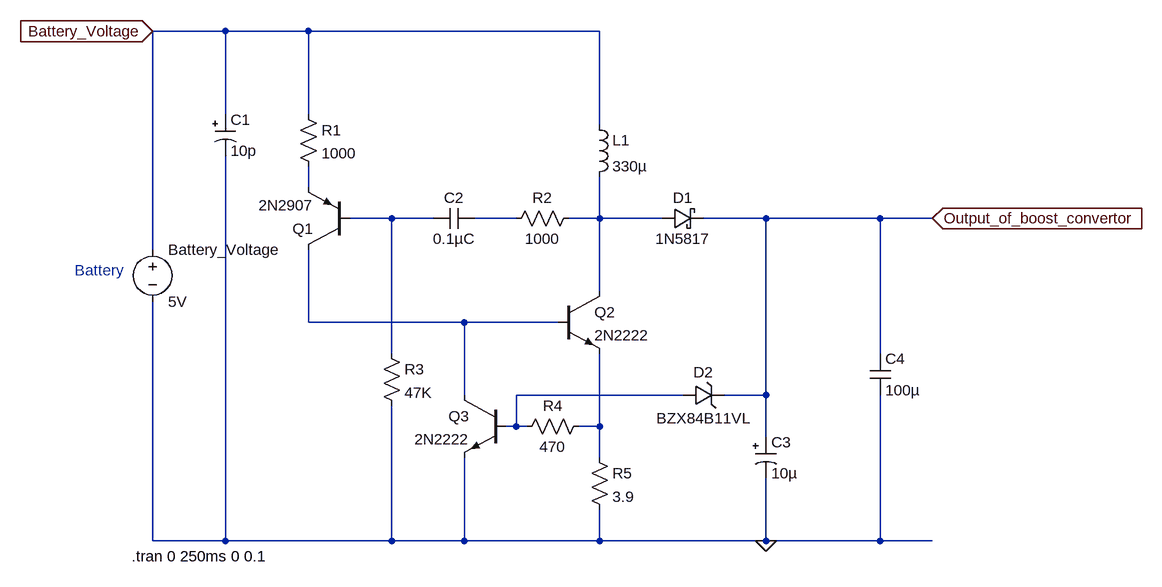
[diagram p0: schematic boost convertor.asc]
boost convertor.asc, the LTspice schematic file:
Version 4
SHEET 1 1632 852
WIRE 160 -16 48 -16
WIRE 288 -16 160 -16
WIRE 736 -16 288 -16
WIRE 160 112 160 -16
WIRE 288 112 288 -16
WIRE 736 128 736 -16
WIRE 288 224 288 192
WIRE 416 272 352 272
WIRE 480 272 416 272
WIRE 608 272 544 272
WIRE 736 272 736 208
WIRE 736 272 688 272
WIRE 832 272 736 272
WIRE 992 272 896 272
WIRE 1168 272 992 272
WIRE 1248 272 1168 272
WIRE 48 320 48 -16
WIRE 736 384 736 272
WIRE 288 432 288 320
WIRE 528 432 288 432
WIRE 672 432 528 432
WIRE 416 480 416 272
WIRE 1168 480 1168 272
WIRE 528 544 528 432
WIRE 864 544 608 544
WIRE 992 544 992 272
WIRE 992 544 928 544
WIRE 608 592 608 544
WIRE 608 592 592 592
WIRE 624 592 608 592
WIRE 736 592 736 480
WIRE 736 592 704 592
WIRE 992 608 992 544
WIRE 736 640 736 592
WIRE 48 768 48 400
WIRE 160 768 160 176
WIRE 160 768 48 768
WIRE 416 768 416 560
WIRE 416 768 160 768
WIRE 528 768 528 640
WIRE 528 768 416 768
WIRE 736 768 736 720
WIRE 736 768 528 768
WIRE 992 768 992 672
WIRE 992 768 736 768
WIRE 1168 768 1168 544
WIRE 1168 768 992 768
WIRE 1248 768 1168 768
FLAG 992 768 0
FLAG 1248 272 Output_of_boost_convertor
IOPIN 1248 272 In
FLAG 48 -16 Battery_Voltage
IOPIN 48 -16 In
SYMBOL polcap 144 112 R0
SYMATTR InstName C1
SYMATTR Value 10p
SYMBOL res 272 96 R0
SYMATTR InstName R1
SYMATTR Value 1000
SYMBOL pnp 352 320 R180
SYMATTR InstName Q1
SYMATTR Value 2N2907
SYMBOL cap 544 256 R90
WINDOW 0 0 32 VBottom 2
WINDOW 3 32 32 VTop 2
SYMATTR InstName C2
SYMATTR Value 0.1µC
SYMBOL res 704 256 R90
WINDOW 0 0 56 VBottom 2
WINDOW 3 32 56 VTop 2
SYMATTR InstName R2
SYMATTR Value 1000
SYMBOL ind 720 112 R0
SYMATTR InstName L1
SYMATTR Value 330µ
SYMBOL schottky 832 288 R270
WINDOW 0 32 32 VTop 2
WINDOW 3 0 32 VBottom 2
SYMATTR InstName D1
SYMATTR Value 1N5817
SYMATTR Description Diode
SYMATTR Type diode
SYMBOL npn 672 384 R0
SYMATTR InstName Q2
SYMATTR Value 2N2222
SYMBOL res 400 464 R0
SYMATTR InstName R3
SYMATTR Value 47K
SYMBOL npn 592 544 M0
SYMATTR InstName Q3
SYMATTR Value 2N2222
SYMBOL res 720 576 R90
WINDOW 0 0 56 VBottom 2
WINDOW 3 32 56 VTop 2
SYMATTR InstName R4
SYMATTR Value 470
SYMBOL zener 864 560 R270
WINDOW 0 36 32 VTop 2
WINDOW 3 -4 32 VBottom 2
SYMATTR InstName D2
SYMATTR Value BZX84B11VL
SYMBOL res 720 624 R0
SYMATTR InstName R5
SYMATTR Value 3.9
SYMBOL polcap 976 608 R0
SYMATTR InstName C3
SYMATTR Value 10µ
SYMBOL voltage 48 304 R0
WINDOW 123 0 0 Left 0
WINDOW 39 0 0 Left 0
SYMATTR InstName Battery_Voltage
SYMATTR Value 5V
SYMBOL cap 1152 480 R0
SYMATTR InstName C4
SYMATTR Value 100µ
TEXT 16 792 Left 2 !.tran 0 250ms 0 0.1
TEXT -72 352 Left 2 ;Battery

The netlist it stands for:
* boost convertor.asc
C1 Battery_Voltage 0 10p
R1 Battery_Voltage N001 1000
Q1 N005 N002 N001 0 2N2907
C2 N003 N002 0.1µC
R2 N004 N003 1000
L1 Battery_Voltage N004 330µ
D1 N004 Output_of_boost_convertor 1N5817
Q2 N004 N005 N007 0 2N2222
R3 N002 0 47K
Q3 N005 N006 0 0 2N2222
R4 N007 N006 470
D2 N006 Output_of_boost_convertor BZX84B11VL
R5 N007 0 3.9
C3 Output_of_boost_convertor 0 10µ
V§Battery_Voltage Battery_Voltage 0 5V
C4 Output_of_boost_convertor 0 100µ
.model D D
.lib standard.dio
.model NPN NPN
.model PNP PNP
.lib standard.bjt
.tran 0 250ms 0 0.1
* Battery
.backanno
.end